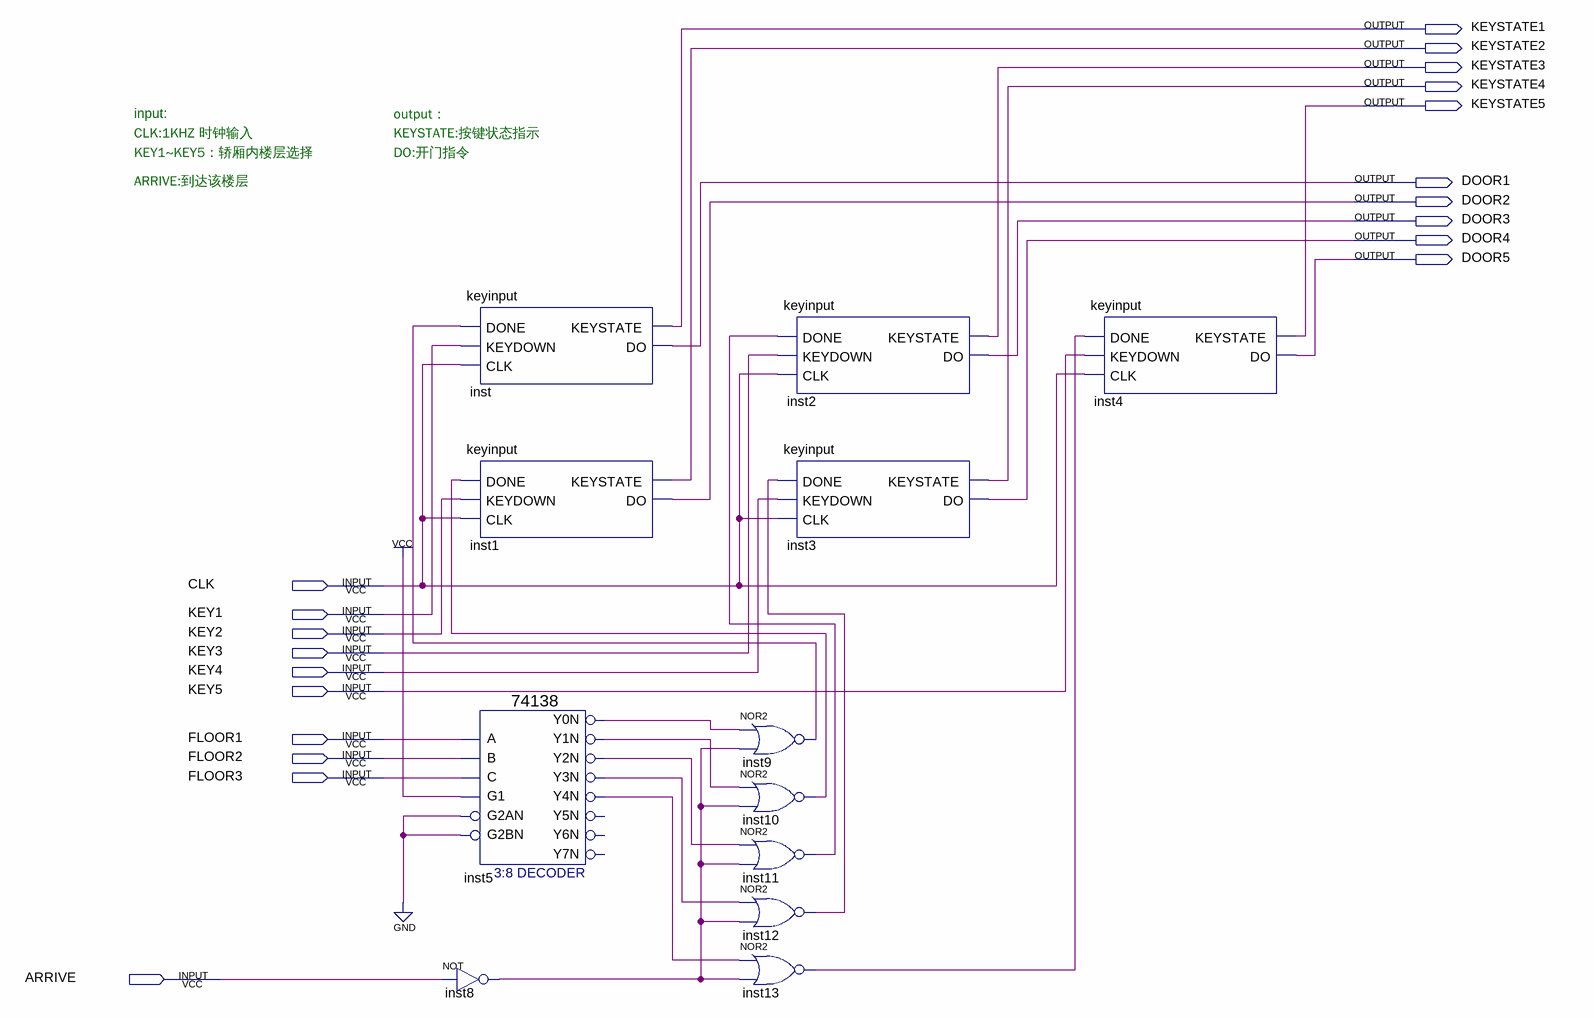
[diagram p0: schematic sheet]
// Quartus schematic floorchoice.bdf as structural Verilog: 12 symbols, 20 pins
module floorchoice (
  input  CLK,
  input  KEY1,
  input  KEY2,
  input  KEY3,
  input  KEY4,
  input  KEY5,
  input  FLOOR1,
  input  FLOOR2,
  input  FLOOR3,
  input  ARRIVE,
  output KEYSTATE1,
  output KEYSTATE2,
  output KEYSTATE3,
  output KEYSTATE4,
  output KEYSTATE5,
  output DOOR1,
  output DOOR2,
  output DOOR3,
  output DOOR4,
  output DOOR5
);

  wire inst5_y0n, inst5_y1n, inst5_y2n, inst5_y3n, inst5_y4n, inst8_out, inst9_out, inst10_out, inst11_out,
       inst12_out, inst13_out;

  not inst8 (inst8_out, ARRIVE);
  keyinput inst (.DONE(inst9_out), .KEYDOWN(KEY1), .CLK(CLK), .KEYSTATE(KEYSTATE1), .DO(DOOR1));
  keyinput inst1 (.DONE(inst10_out), .KEYDOWN(KEY2), .CLK(CLK), .KEYSTATE(KEYSTATE2), .DO(DOOR2));
  \74138  inst5 (
    .A(FLOOR1), .B(FLOOR2), .G1(1'b1), .C(FLOOR3), .G2AN(1'b0), .G2BN(1'b0), .Y0N(inst5_y0n),
    .Y1N(inst5_y1n), .Y2N(inst5_y2n), .Y3N(inst5_y3n), .Y4N(inst5_y4n));  // open: Y5N, Y6N, Y7N
  nor inst9 (inst9_out, inst5_y0n, inst8_out);
  nor inst10 (inst10_out, inst5_y1n, inst8_out);
  nor inst11 (inst11_out, inst5_y2n, inst8_out);
  nor inst12 (inst12_out, inst5_y3n, inst8_out);
  nor inst13 (inst13_out, inst5_y4n, inst8_out);
  keyinput inst2 (.DONE(inst11_out), .KEYDOWN(KEY3), .CLK(CLK), .KEYSTATE(KEYSTATE3), .DO(DOOR3));
  keyinput inst3 (.DONE(inst12_out), .KEYDOWN(KEY4), .CLK(CLK), .KEYSTATE(KEYSTATE4), .DO(DOOR4));
  keyinput inst4 (.DONE(inst13_out), .KEYDOWN(KEY5), .CLK(CLK), .KEYSTATE(KEYSTATE5), .DO(DOOR5));

  // Notes on the sheet:
  //   input:
  //   output：
  //   CLK:1KHZ 时钟输入
  //   KEYSTATE:按键状态指示
  //   KEY1~KEY5：轿厢内楼层选择
  //   DO:开门指令
  //   ARRIVE:到达该楼层
endmodule
